# Altium schematic sheet LED_5730 2.SchDoc
size A; PageSetup: Record=PageOptions|CenterHorizontal=True|CenterVertical=True|PrintScale=1.12|XCorrection=1.00|YCorrection=1.00|PrintKind=2|BorderSize=5000000|LeftOffset=0|BottomOffset=0|Orientation=2|PaperLength=1000|PaperWidth=1000|Scale=100|PaperSource=7|PrintQuality=-3|MediaType=1|DitherType=10|PrintScaleMode=1|PaperKind=Letter|PaperIndex=1
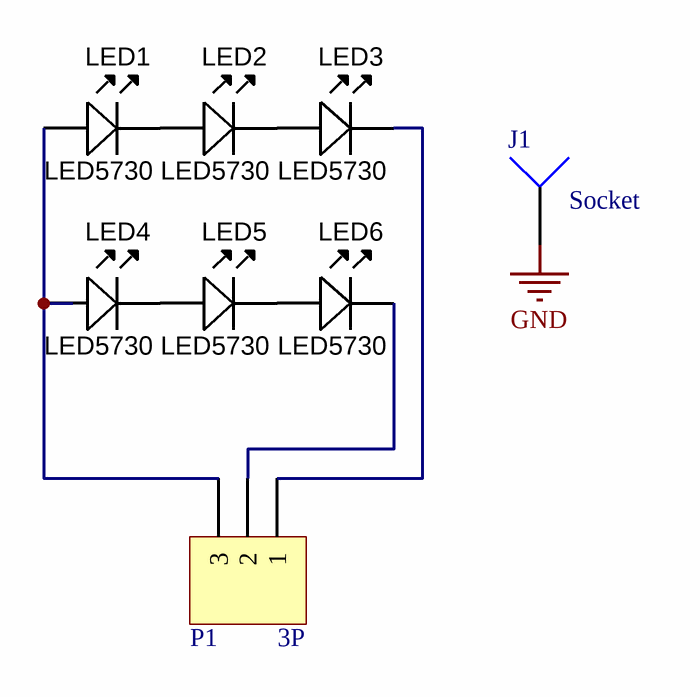
[diagram p0: LED_5730 2.SchDoc]

## Parts
J1  Socket  [lobatoc]
LED1  Color: LED5730  [5730]  (hidden comment: LED 5730 chân dán)
LED2  Color: LED5730  [5730]  (hidden comment: LED 5730 chân dán)
LED3  Color: LED5730  [5730]  (hidden comment: LED 5730 chân dán)
LED4  Color: LED5730  [5730]  (hidden comment: LED 5730 chân dán)
LED5  Color: LED5730  [5730]  (hidden comment: LED 5730 chân dán)
LED6  Color: LED5730  [5730]  (hidden comment: LED 5730 chân dán)
P1  value 3P  [HDR1X3H]  (hidden comment: Jump đực chân thẳng, 2.54mm 3P)

## Nets
GND: J1.1
NetLED1_A: LED1.A LED4.A P1.3
NetLED1_K: LED1.K LED2.A
NetLED2_K: LED2.K LED3.A
NetLED3_K: LED3.K P1.1
NetLED4_K: LED4.K LED5.A
NetLED5_K: LED5.K LED6.A
NetLED6_K: LED6.K P1.2

## Library data of the parts
LED1-LED6 = LED_SMD_Blue_0805_100mcd: LED 0805 SMD Blue 100mcd 470nm; Manufacturer 1: Ligitek; Manufacturer Part Number 1: LG-170DBKZ-CT; Material: InGaN/GaN; Ratings: 100 mcd; 470 nm; Package / Case: 0805; Value: LED5730
P1 = Header 3H: Header, 3-Pin, Right Angle; LatestRevisionDate: 17-Jul-2002; LatestRevisionNote: Re-released for DXP Platform.; Publisher: Altium Limited
J1 = Socket: LatestRevisionDate: 17-Jul-2002; LatestRevisionNote: Re-released for DXP Platform.; Publisher: Altium Limited